# EasyEDA Pro project Universal Receiver.epro

# Schematic Schematic
Board Name: Universal Receiver; Create Date: 2025-03-07; Page Name: Schematic; Project Name: Universal Receiver; Schematic Name: Schematic; Update Date: 2025-03-08; Add into BOM: yes; Company: MUS; Convert to PCB: yes; Date: 2025-03-07; REV: 1.0; Sheet: 1/1
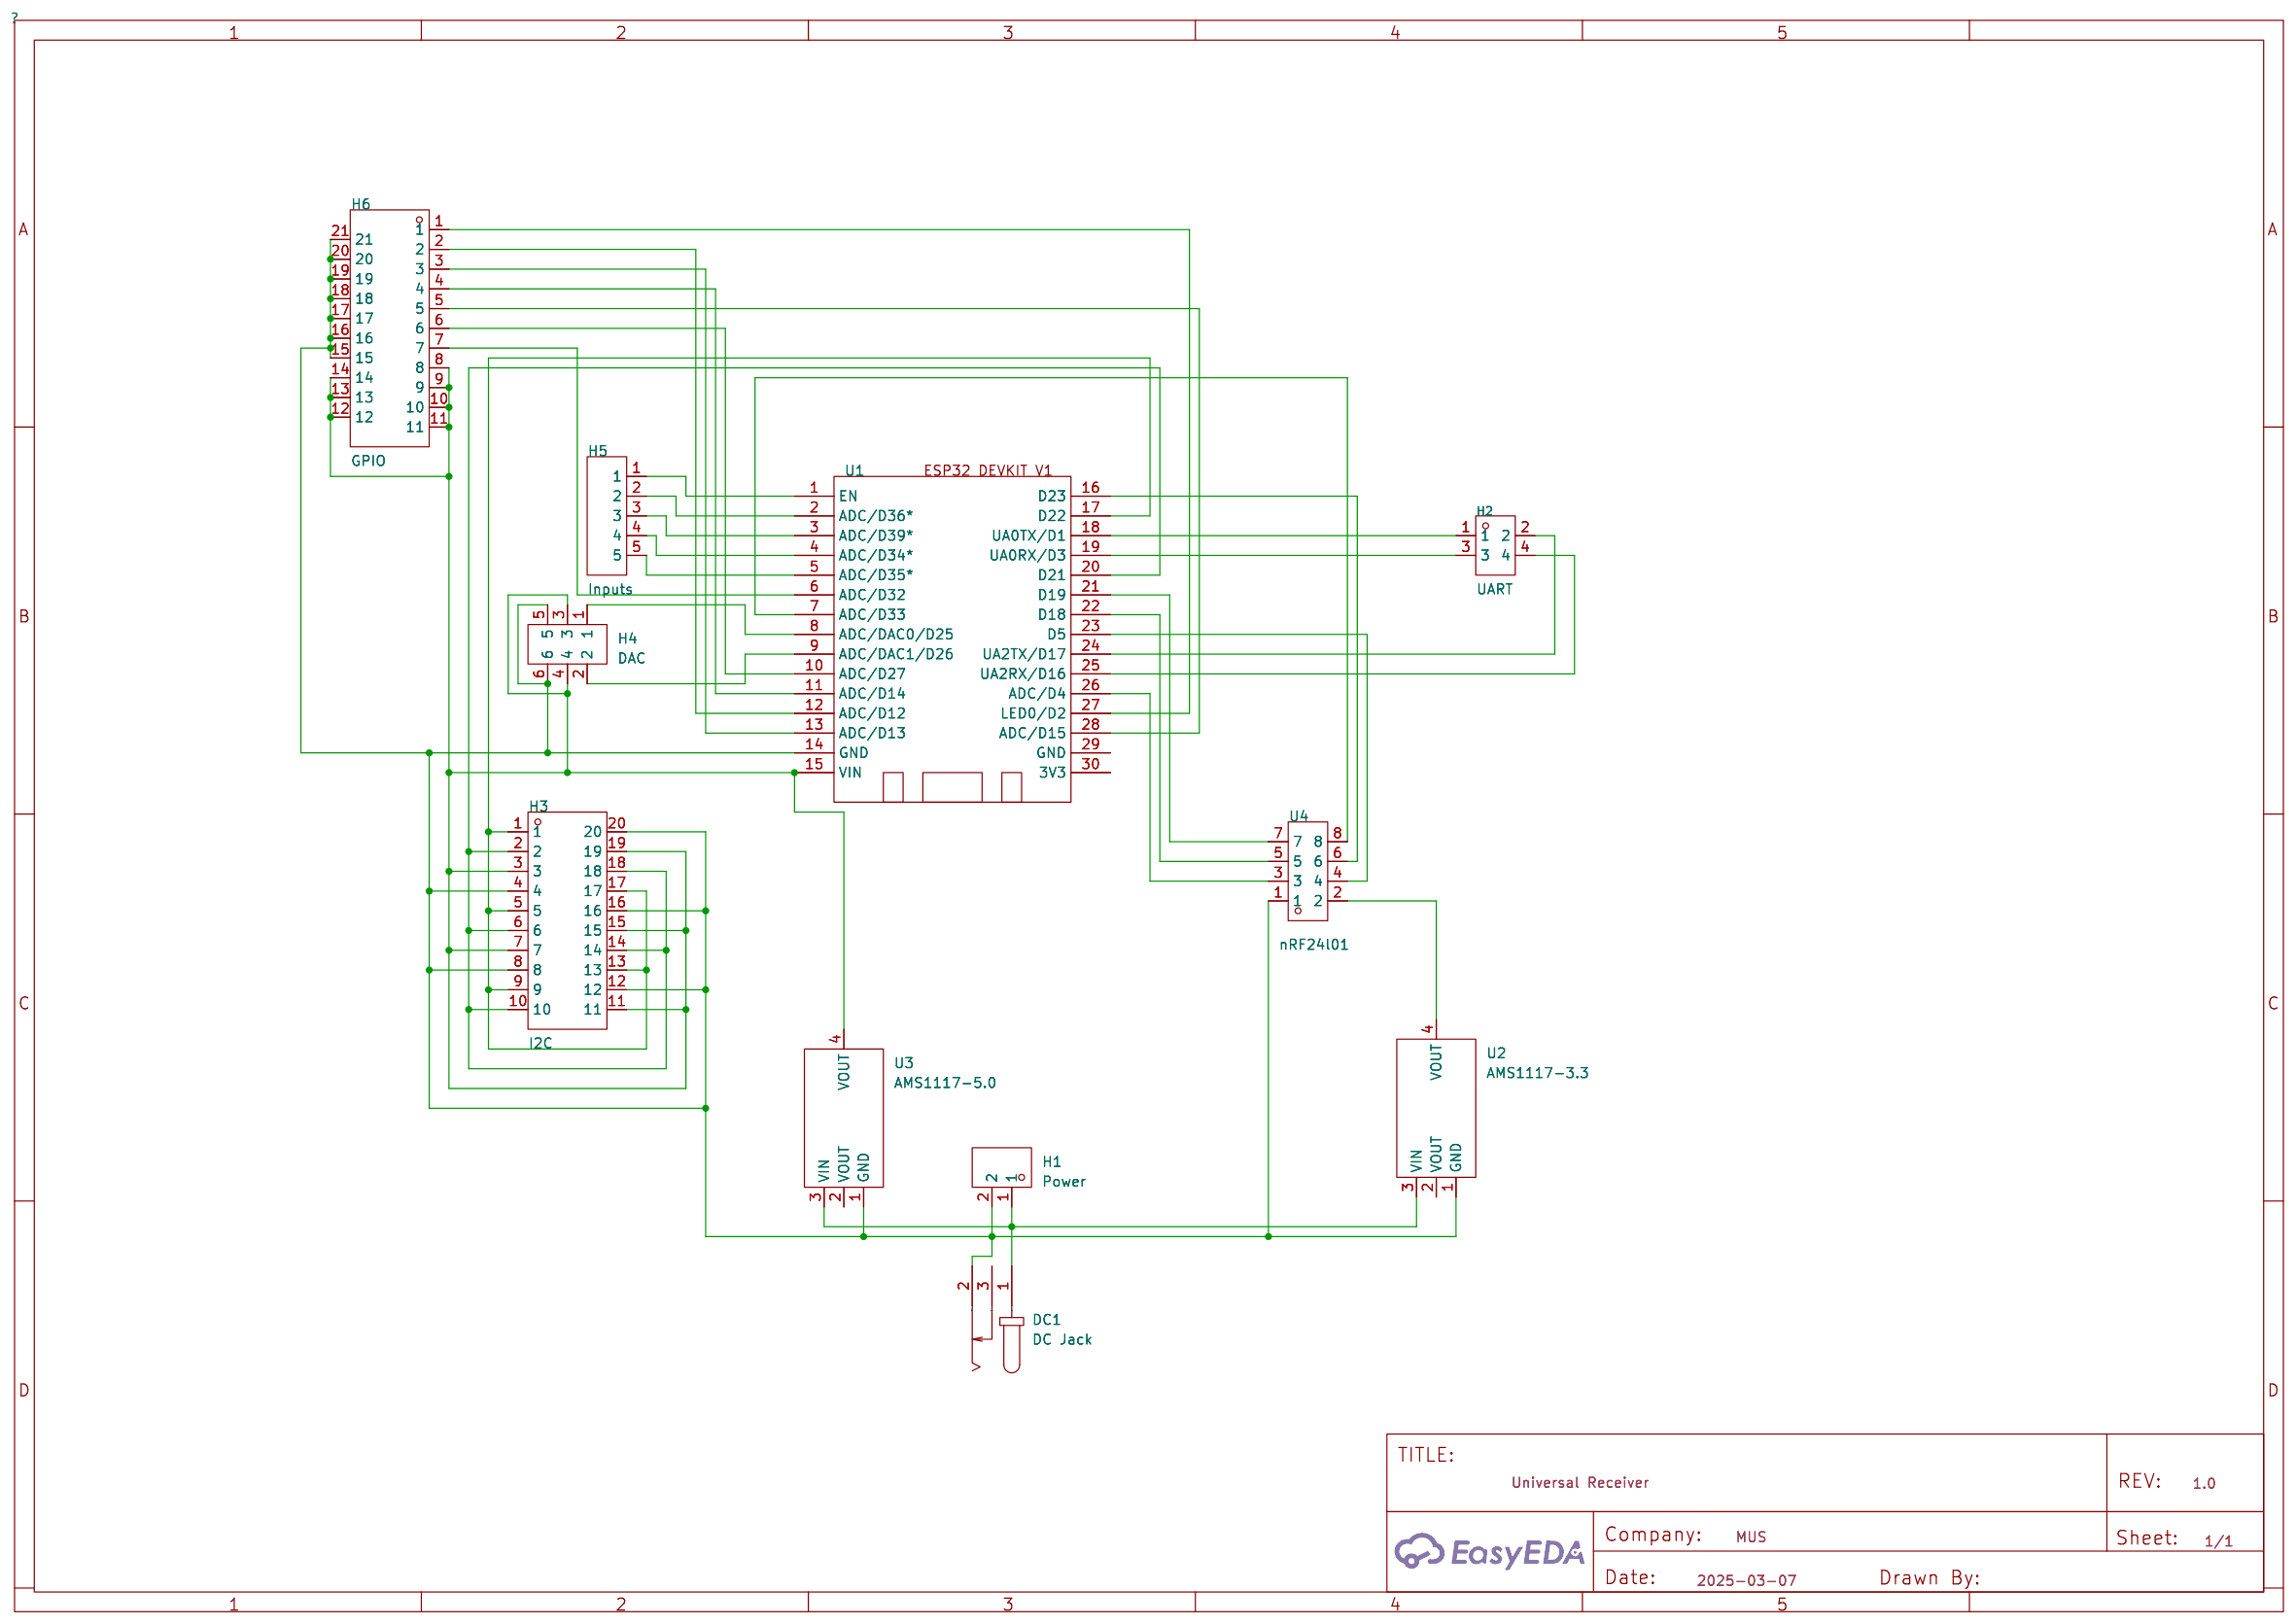
[diagram p0: schematic sheet]

## Parts
DC1  DC Jack  [DC-IN-TH_DC-005-5A-2.0]
H1  Power  [HDR-TH_2P-P2.54-V-M_5]
H2  UART  [HDR-TH_4P-P2.54-V-M-R2-C2-S2.54]
H3  I2C  [HDR-TH_20P-P2.54-V-M-R4-C5-S2.54]
H4  DAC  [HDR-TH_6P-P2.54-V-M-R2-C3-S2.54]
H5  Inputs  [HDR-TH_5P-P2.54-V-M]
H6  GPIO  [CONN-TH_HX-PZ2.54-3X7P-ZZ]
U1  -  [ESP32 Devkit V1]
U2  AMS1117-3.3  [SOT-223-3_L6.5-W3.4-P2.30-LS7.0-BR]
U3  AMS1117-5.0  [SOT-223_L6.5-W3.5-P2.30-LS7.0-BR]
U4  nRF24l01  [HDR-TH_8P-P2.54-V-F-R2-C4-S2.54]

## Library data of the parts
DC1 = DC-005-5A-2.0: Connector Type:DC Power Receptacle Mounting Style:Bend insert Inside Contact Diameter:2mm Outside Contact Diameter:6.2mm Current Rating (Max):5A Voltage Rating (Max):24V Operating Temperature Range:-20℃~+70℃ Operating Temperature Range:-20℃~+70℃; LCSC Part Name: DC电源插座 内径:2mm 外径:6.2mm; Supplier Part: C381116; Manufacturer: XKB Connection(中国星坤); Supplier Footprint: 插件; JLCPCB Part Class: Extended Part; Datasheet: https://atta.szlcsc.com/upload/public/pdf/source/20211015/707A35F7AB6E89C57AAB641950105BB7.pdf; Supplier: LCSC; Connector Type: DC Power Receptacle; Mounting Style: Bend insert; Inside Contact Diameter: 2mm; Outside Contact Diameter: 6.2mm; Current Rating (Max): 5A; Voltage Rating (Max): 24V; Operating Temperature Range: -20℃~+70℃
H1 = PZ254-1-02-Z-C: Pin Structure:1x2P Pitch:2.54mm Row Spacing:- Circluar Pins/Square Pins:Circular Pins Mounting Type:Straight Number of Rows:Plugin Number of Pins:2P Current Rating (Max):3A Length of Mating Pin:4.13mm Insulation Height:3mm Length of End Connection Pin:3mm; LCSC Part Name: 1x2P 间距:2.54mm 圆针 直插; Supplier Part: C5156429; Manufacturer: HCTL(华灿天禄); Supplier Footprint: 插件,P=2.54mm; JLCPCB Part Class: Extended Part; Datasheet: https://atta.szlcsc.com/upload/public/pdf/source/20230609/791AB95BE9F63E00E86E05F9E750B3EF.pdf; Supplier: LCSC; Pin Structure: 1x2P; Pitch: 2.54mm; Circluar Pins/Square Pins: Circular Pins; Mounting Type: Straight; Number of Rows: Plugin; Number of Pins: 2P; Current Rating (Max): 3A; Length of Mating Pin: 4.13mm; Insulation Height: 3mm; Length of End Connection Pin: 3mm; Contact Plating: Gold; Operating Temperature Range: -40℃~+105℃; Soldering Temperature(Max): 260℃@10S; Color: Black
H2 = PZ254-2-02-Z-2.5-G1: Pin Structure:2x2P Pitch:2.54mm Row Spacing:2.54mm Circluar Pins/Square Pins:Square Pins Mounting Type:Straight Number of Rows:双排 Number of Pins:4P Current Rating (Max):3A Length of Mating Pin:6mm Insulation Height:2.5mm Length of End Connection Pin:3mm C; LCSC Part Name: 2x2P 间距:2.54mm 方针 直插; Supplier Part: C18197997; Manufacturer: HCTL(华灿天禄); Supplier Footprint: 插件,P=2.54mm; JLCPCB Part Class: Extended Part; Datasheet: https://atta.szlcsc.com/upload/public/pdf/source/20230921/D8C53D635FAFF8233B09D1367D616037.pdf; Supplier: LCSC; Pin Structure: 2x2P; Pitch: 2.54mm; Row Spacing: 2.54mm; Circluar Pins/Square Pins: Square Pins; Mounting Type: Straight; Number of Rows: 双排; Number of Pins: 4P; Current Rating (Max): 3A; Length of Mating Pin: 6mm; Insulation Height: 2.5mm; Length of End Connection Pin: 3mm; Operating Temperature Range: -40℃~+105℃; Soldering Temperature(Max): 260℃@10S; Color: Black
H3 = HX PZ2.54-4x5P ZZ: Pin Structure:4x5P Pitch:2.54mm Row Spacing:2.54mm Circluar Pins/Square Pins:Policy Mounting Type:Direct Insert Number of Rows:Four rows Number of Pins:20P Current Rating (Max):3A Voltage Rating (Max):- Length of Mating Pin:6mm Insulation Height:2.5mm Len; LCSC Part Name: 4x5P 间距:2.54mm 方针 直插; Supplier Part: C32713299; Manufacturer: hanxia(韩下); Supplier Footprint: 插件,P=2.54mm; JLCPCB Part Class: Extended Part; Datasheet: https://atta.szlcsc.com/upload/public/pdf/source/20240723/6A176166D1A76A78CC2FA8FC287512BB.pdf; Supplier: LCSC; Pin Structure: 4x5P; Pitch: 2.54mm; Row Spacing: 2.54mm; Circluar Pins/Square Pins: Policy; Mounting Type: Direct Insert; Number of Rows: Four rows; Number of Pins: 20P; Current Rating (Max): 3A; Length of Mating Pin: 6mm; Insulation Height: 2.5mm; Length of End Connection Pin: 3mm; Contact Material: Brass; Contact Plating: Gold; Operating Temperature Range: -40℃~+105℃; Color: Black
H4 = DS1021-2x3SF11-B: Pin Structure:2x3P Pitch:2.54mm Mounting Type:Straight Number of Rows:Double Row Number of Pins:6P; LCSC Part Name: 2x3P 间距:2.54mm 直插; Supplier Part: C7430399; Manufacturer: CONNFLY; Supplier Footprint: 插件,P=2.54mm; JLCPCB Part Class: Extended Part; Datasheet: https://atta.szlcsc.com/upload/public/pdf/source/20241114/CDE0584BC14A5BF7A4A12431B1315AA3.pdf; Supplier: LCSC; Pin Structure: 2x3P; Pitch: 2.54mm; Mounting Type: Straight; Number of Rows: Double Row; Number of Pins: 6P
H5 = PZ254V-11-05P: Pin Structure:1x5P Pitch:2.54mm Row Spacing:- Circluar Pins/Square Pins:Policy Mounting Type:Straight Number of Rows:Single Row Number of Pins:5P Current Rating:- Voltage Rating (Max):- Length of Mating Pin:6mm Insulation Height:2.5mm Length of End Connec; LCSC Part Name: 1x5P 间距:2.54mm 方针 直插; Supplier Part: C492404; Manufacturer: XFCN(兴飞); Supplier Footprint: 插件,P=2.54mm; JLCPCB Part Class: Extended Part; Datasheet: https://atta.szlcsc.com/upload/public/pdf/source/20200309/C492404_E51533260F8710EFF5D4617281164C1D.pdf; Supplier: LCSC; Pin Structure: 1x5P; Pitch: 2.54mm; Circluar Pins/Square Pins: Policy; Mounting Type: Straight; Number of Rows: Single Row; Number of Pins: 5P; Length of Mating Pin: 6mm; Insulation Height: 2.5mm; Length of End Connection Pin: 3mm; Contact Material: Brass; Operating Temperature: -40℃~+105℃; Color: Black
H6 = HX PZ2.54-3x7P ZZ: Pin Structure:3x7P Pitch:2.54mm Row Spacing:2.54mm Circluar Pins/Square Pins:Policy Mounting Type:Straight Number of Rows:Triple row Number of Pins:21P Current Rating:3A Voltage Rating (Max):- Length of Mating Pin:6mm Insulation Height:2.5mm Length of End; LCSC Part Name: 3x7P 间距:2.54mm 方针 直插; Supplier Part: C32713294; Manufacturer: hanxia(韩下); Supplier Footprint: 插件,P=2.54mm; JLCPCB Part Class: Extended Part; Datasheet: https://atta.szlcsc.com/upload/public/pdf/source/20240723/0865035114635720ADAE8B7B33218890.pdf; Supplier: LCSC; Pin Structure: 3x7P; Pitch: 2.54mm; Row Spacing: 2.54mm; Circluar Pins/Square Pins: Policy; Mounting Type: Straight; Number of Rows: Triple row; Number of Pins: 21P; Current Rating: 3A; Length of Mating Pin: 6mm; Insulation Height: 2.5mm; Length of End Connection Pin: 3mm; Contact Material: Brass; Contact Plating: Gold; Operating Temperature: -40℃~+105℃; Color: Black
U1 = ESP32 Devkit V1
U2 = AMS1117-3.3_C6186: Output Type:Fixed Voltage - Supply:- Output Voltage:3.3V Output Voltage:3.3V Output Current:1A Power Supply Rejection Ratio (PSRR):72dB@(120Hz) Voltage Dropout:1.3V@(800mA) standby current:- Noise:- Features:Overcurrent Protection(OCP)；Thermal Protection(; LCSC Part Name: 输出3.3V 1A; Supplier Part: C6186; Manufacturer: AMS; Supplier Footprint: SOT-223; JLCPCB Part Class: Basic Part; Datasheet: https://atta.szlcsc.com/upload/public/pdf/source/20180727/C6186_7A095716F0823C02F1997A905E26C086.pdf; Supplier: LCSC; Output Type: Fixed; Output Voltage: 3.3V; Output Current: 1A; Power Supply Rejection Ratio (PSRR): 72dB@(120Hz); Voltage Dropout: 1.3V@(800mA); Features: Overcurrent Protection(OCP)；Thermal Protection(TSD); Output Configuration: Positive electrode; Number of Outputs: 1
U3 = AMS1117-5.0_C6187: Output Type:Fixed Voltage - Supply:12V Output Voltage:5V Output Voltage:5V Output Current:1A Power Supply Rejection Ratio (PSRR):- Voltage Dropout:1.3V@(1A) standby current:- Noise:- Features:Overcurrent Protection(OCP) Operating Temperature:- Operating T; LCSC Part Name: 输入12V 输出5V 1A; Supplier Part: C6187; Manufacturer: AMS; Supplier Footprint: SOT-223; JLCPCB Part Class: Basic Part; Datasheet: https://atta.szlcsc.com/upload/public/pdf/source/20230918/E4B716057EE82179D88E8A0894830D59.pdf; Supplier: LCSC; Output Type: Fixed; Voltage - Supply: 12V; Output Voltage: 5V; Output Current: 1A; Voltage Dropout: 1.3V@(1A); Features: Overcurrent Protection(OCP); Output Configuration: Positive electrode; Number of Outputs: 1
U4 = 2.54-2*4: Holes Structure:2x4P Pitch:2.54mm Row Spacing:2.54mm Circular Hole / Square Hole:Square Holes Mounting Type:Straight Number of Rows:双排 Number of Holes:8P Current Rating (Max):2.5A Voltage Rating (Max):- Holes Direction:Top Insulation Height:8.5mm Operatin; LCSC Part Name: 间距:2.54mm 2x4P 直插; Supplier Part: C2977588; Manufacturer: ZHOURI(洲日); Supplier Footprint: 插件,P=2.54mm; JLCPCB Part Class: Extended Part; Datasheet: https://atta.szlcsc.com/upload/public/pdf/source/20220328/363EB391BC0EB759CF231FC910753CBE.pdf; Supplier: LCSC; Holes Structure: 2x4P; Pitch: 2.54mm; Row Spacing: 2.54mm; Circular Hole / Square Hole: Square Holes; Mounting Type: Straight; Number of Rows: 双排; Number of Holes: 8P; Current Rating (Max): 2.5A; Holes Direction: Top; Insulation Height: 8.5mm; Operating Temperature Range: -40℃~+105℃

## Nets
$1N346: DC1.1 H1.1 U2.3(VIN) U3.3(VIN)
$1N376: H3.1 H3.5 H3.9 H3.13 H3.17 U1.17(D22)
$1N382: H3.2 H3.6 H3.10 H3.14 H3.18 U1.20(D21)
$1N389: H3.3 H3.7 H3.11 H3.15 H3.19 H4.3 H4.4 H6.8 H6.9 H6.10 H6.11 H6.12 H6.13 H6.14 U1.15(VIN) U3.4(VOUT)
$1N396: DC1.2 H1.2 H3.4 H3.8 H3.12 H3.16 H3.20 H4.5 H4.6 H6.15 H6.16 H6.17 H6.18 H6.19 H6.20 H6.21 U1.14(GND) U2.1(GND) U3.1(GND) U4.1
$1N934: U2.4(VOUT) U4.2
$1N970: U1.26(ADC/D4) U4.3
$1N976: U1.22(D18) U4.5
$1N983: U1.21(D19) U4.7
$1N990: U1.7(ADC/D33) U4.8
$1N998: U1.16(D23) U4.6
$1N1005: U1.23(D5) U4.4
$1N1349: H2.3 U1.19(UA0RX/D3)
$1N1355: H2.1 U1.18(UA0TX/D1)
$1N1359: H2.2 U1.24(UA2TX/D17)
$1N1366: H2.4 U1.25(UA2RX/D16)
$1N1470: H4.1 U1.8(ADC/DAC0/D25)
$1N1476: H4.2 U1.9(ADC/DAC1/D26)
$1N1730: H5.5 U1.5(ADC/D35*)
$1N1735: H5.4 U1.4(ADC/D34*)
$1N1742: H5.3 U1.3(ADC/D39*)
$1N1749: H5.2 U1.2(ADC/D36*)
$1N1759: H5.1 U1.1(EN)
$1N2197: H6.1 U1.27(LED0/D2)
$1N2203: H6.2 U1.12(ADC/D12)
$1N2209: H6.3 U1.13(ADC/D13)
$1N2216: H6.4 U1.11(ADC/D14)
$1N2223: H6.5 U1.28(ADC/D15)
$1N2230: H6.6 U1.10(ADC/D27)
$1N2243: H6.7 U1.6(ADC/D32)

Not connected (* = marked no-connect by the designer): DC1 3; U1 29(GND) 30(3V3); U2 2(VOUT); U3 2(VOUT)

# Board PCB
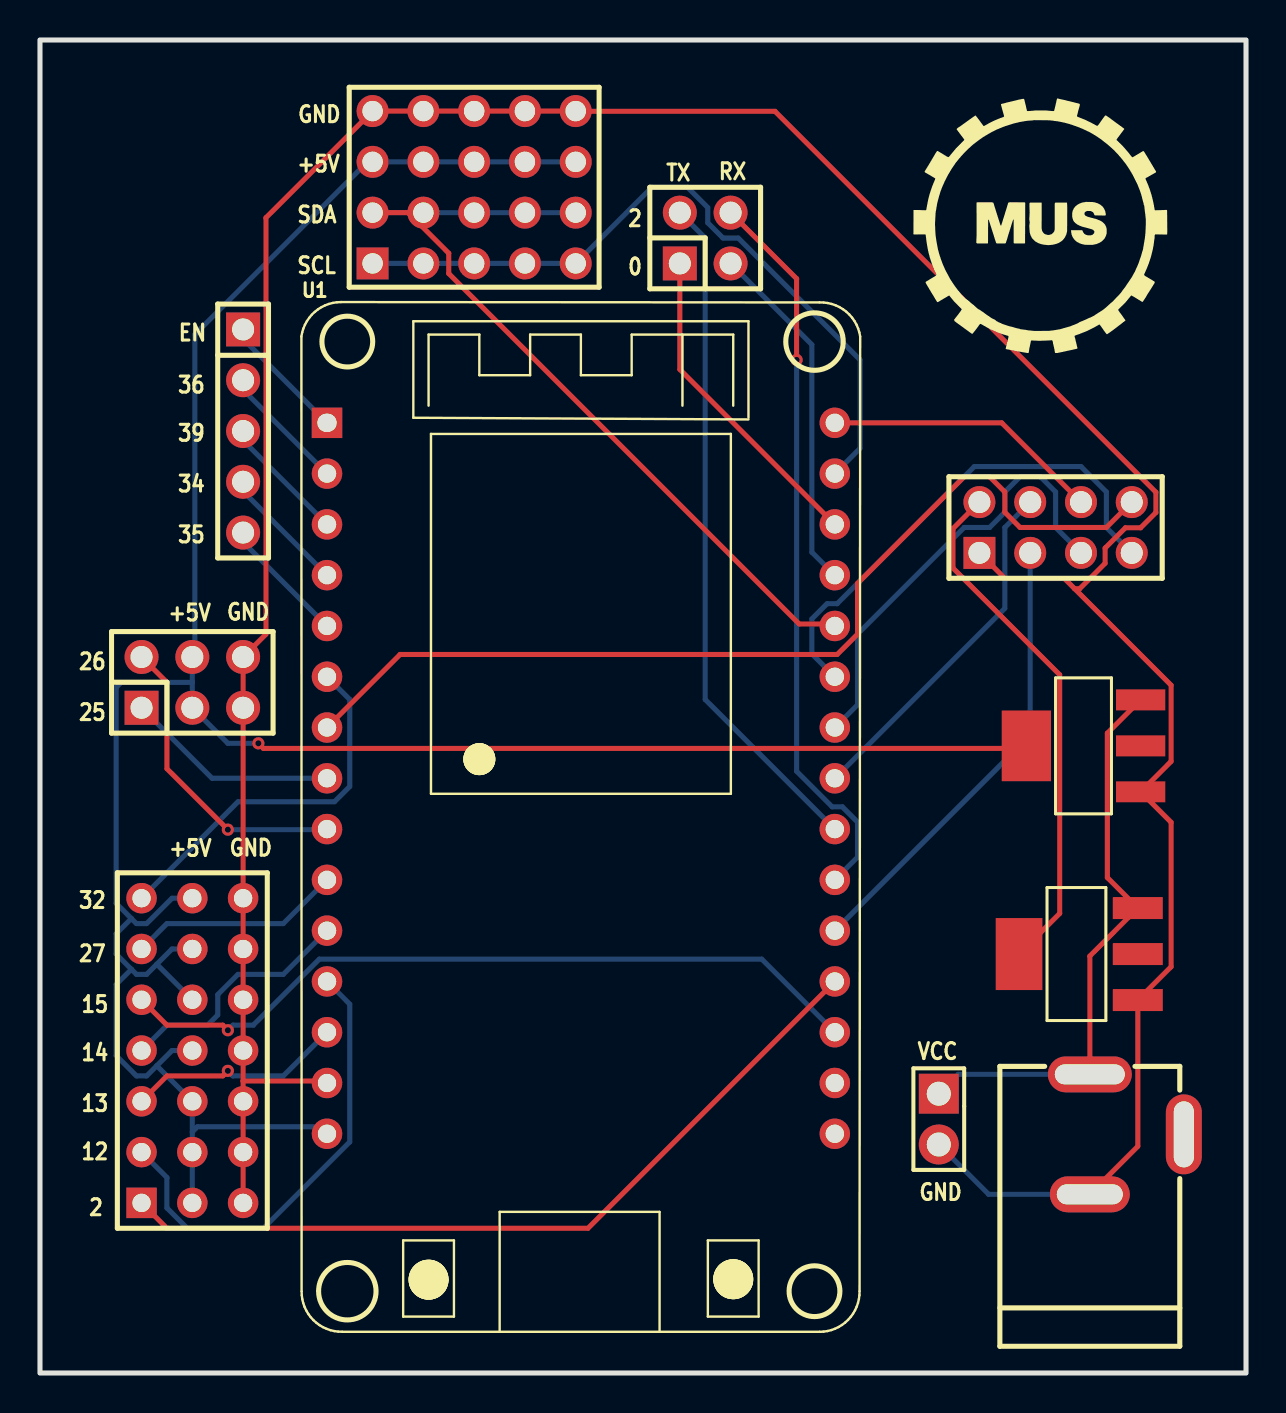
[diagram p1: board, top side]
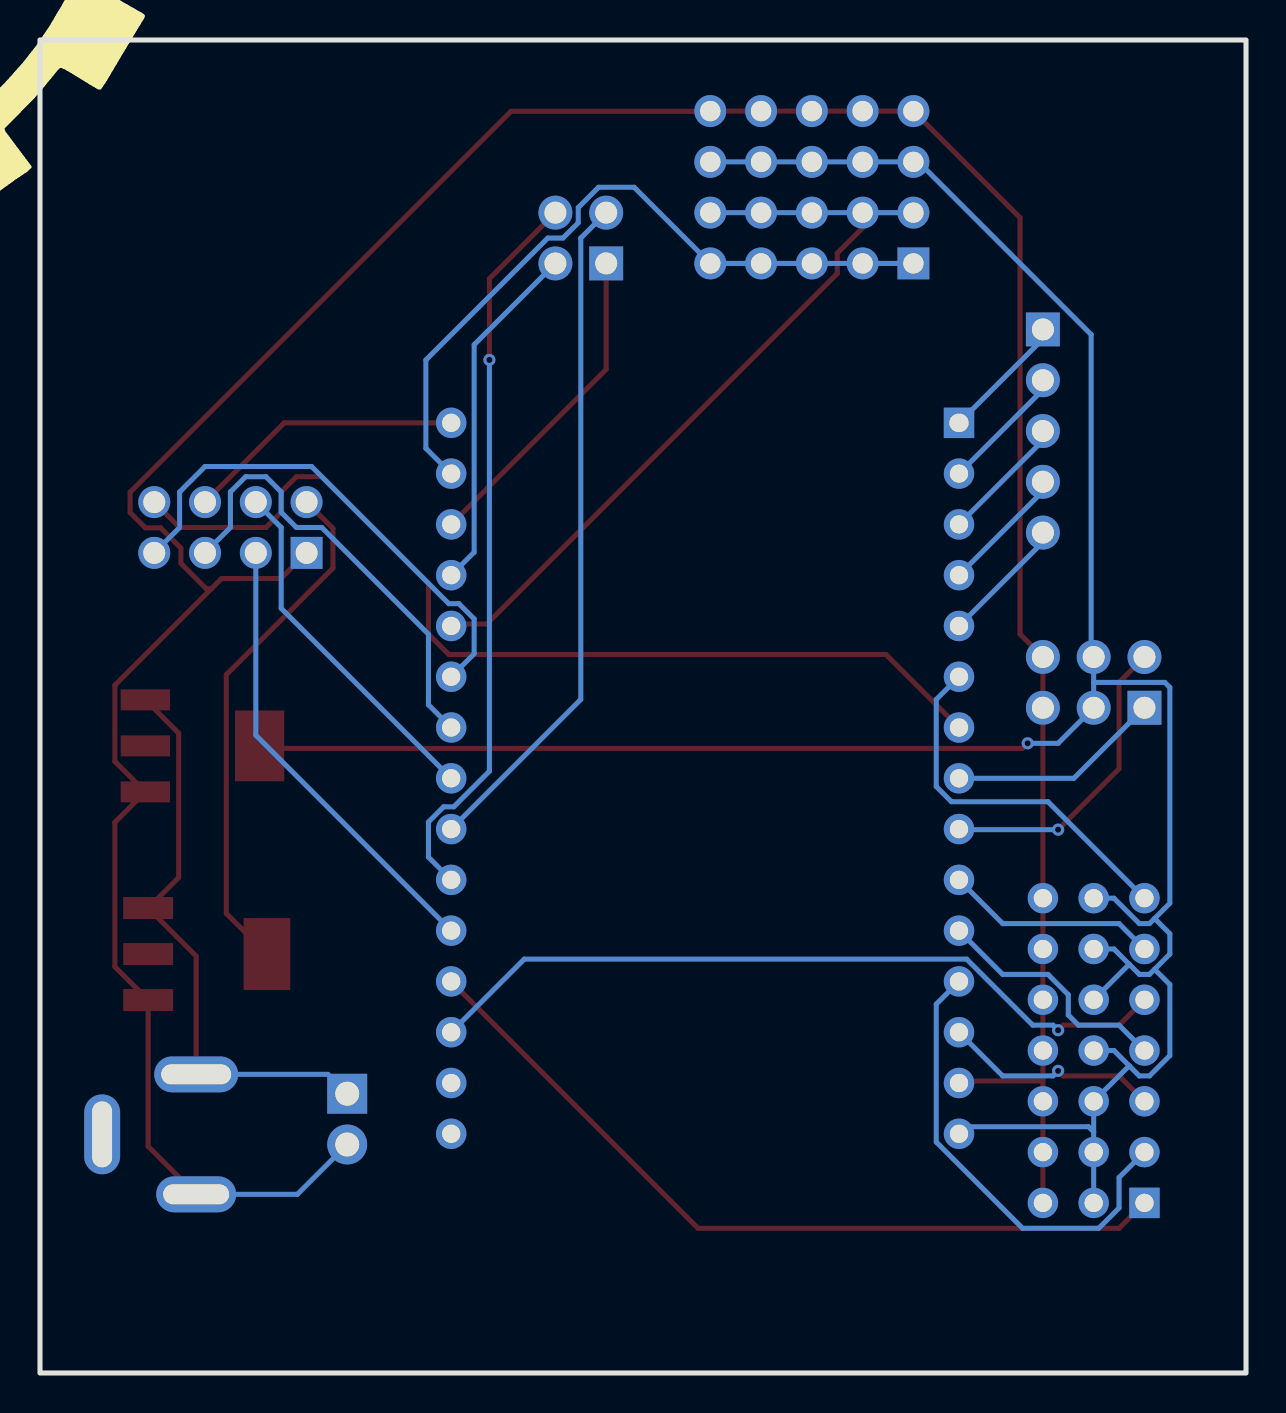
[diagram p2: board, bottom side, seen from below]

Outline 60.32 x 66.67 mm; copper layers: Top Layer, Bottom Layer. Coordinates in mm from the lower left corner of the outline.
Outline path: rectangle 0,66.67 60.32,0
Stack: Top Layer 0.035mm / Dielectric1 1.51mm FR4 er 4.5 / Bottom Layer 0.035mm

## Design rules (mm)
template: JLCPCB Capability(Two Layers Board)
spacing copperThickness1oz (default): track to track 0.102, other pairs 0.152 to 0.3
spacing copperThickness2oz: track to track 0.203, other pairs 0.152 to 0.3
track width copperThickness1oz (default): min 0.127, default 0.254, max 2.54
track width copperThickness2oz: min 0.203, default 0.254, max 2.54
differential pair differentialPair (default): width min 0.127, default 0.254, max 2.54; gap min 0.152, default 0.152
via viaSize (default): diameter min 0.5, default 0.61, max 10; hole min 0.3, default 0.305, max 6.3

## Placement (name value [footprint] x y rotation side)
DC1  DC Jack  [DC-IN-TH_DC-005-5A-2.0]  54.86 11.94 90 top
H1  Power  [HDR-TH_2P-P2.54-V-M_5]  44.96 12.7 270 top
H2  UART  [HDR-TH_4P-P2.54-V-M-R2-C2-S2.54]  33.27 56.77 0 top
H3  I2C  [HDR-TH_20P-P2.54-V-M-R4-C5-S2.54]  21.72 59.31 0 top
H4  DAC  [HDR-TH_6P-P2.54-V-M-R2-C3-S2.54]  7.62 34.54 0 top
H5  Inputs  [HDR-TH_5P-P2.54-V-M]  10.16 47.12 270 top
H6  GPIO  [CONN-TH_HX-PZ2.54-3X7P-ZZ]  7.62 16.13 90 top
U1  -  [ESP32 Devkit V1]  27.05 27.81 0 top
U2  AMS1117-3.3  [SOT-223-3_L6.5-W3.4-P2.30-LS7.0-BR]  51.94 20.95 0 top
U3  AMS1117-5.0  [SOT-223_L6.5-W3.5-P2.30-LS7.0-BR]  52.2 31.37 0 top
U4  nRF24l01  [HDR-TH_8P-P2.54-V-F-R2-C4-S2.54]  50.8 42.29 0 top

## Footprints (pads in the part's own frame, mm; a bottom-side part is the same pattern mirrored in y, then rotated)
CONN-TH_HX-PZ2.54-3X7P-ZZ
  rect 1.524x1.524 hole 0.914: 1(-7.62,2.54)
  round 1.524 hole 0.914: 2(-5.08,2.54) 3(-2.54,2.54) 4(0,2.54) 5(2.54,2.54) 6(5.08,2.54) 7(7.62,2.54) 8(-7.62,0) 9(-5.08,0) 10(-2.54,0) 11(0,0) 12(2.54,0) 13(5.08,0) 14(7.62,0) 15(-7.62,-2.54) 16(-5.08,-2.54) 17(-2.54,-2.54) 18(0,-2.54) 19(2.54,-2.54) 20(5.08,-2.54) 21(7.62,-2.54)
DC-IN-TH_DC-005-5A-2.0
  oval 1.8x4.2 hole 1x3.5: 1(3,2.352)
  oval 1.8x4 hole 1x3.3: 2(-3,2.352)
  oval 4x1.8 hole 3.3x1: 3(-0.001,-2.352)
ESP32 Devkit V1
  rect 1.524x1.524 hole 0.96x0.914: 1(-12.694,19.713)
  round 1.524 hole 0.914: 2(-12.694,17.173) 3(-12.694,14.633) 4(-12.694,12.093) 5(-12.694,9.553) 6(-12.694,7.013) 7(-12.694,4.473) 8(-12.694,1.933) 9(-12.694,-0.607) 10(-12.694,-3.147) 11(-12.694,-5.687) 12(-12.694,-8.227) 13(-12.694,-10.767) 14(-12.694,-13.307) 15(-12.694,-15.847) 16(12.706,19.713) 17(12.706,17.173) 18(12.706,14.633) 19(12.706,12.093) 20(12.706,9.553) 21(12.706,7.013) 22(12.706,4.473) 23(12.706,1.933) 24(12.706,-0.607) 25(12.706,-3.147) 26(12.706,-5.687) 27(12.706,-8.227) 28(12.706,-10.767) 29(12.706,-13.307) 30(12.706,-15.847)
HDR-TH_2P-P2.54-V-M_5
  rect 2x2 hole 1.2: 1(-1.27,0)
  round 2 hole 1.2: 2(1.27,0)
HDR-TH_4P-P2.54-V-M-R2-C2-S2.54
  rect 1.7x1.7 hole 1.1: 1(-1.27,-1.27)
  round 1.7 hole 1.1: 2(-1.27,1.27) 3(1.27,-1.27) 4(1.27,1.27)
HDR-TH_5P-P2.54-V-M
  rect 1.7x1.7 hole 1.1: 1(-5.08,0)
  round 1.7 hole 1.1: 2(-2.54,0) 3(0,0) 4(2.54,0) 5(5.08,0)
HDR-TH_6P-P2.54-V-M-R2-C3-S2.54
  rect 1.7x1.7 hole 1.1: 1(-2.54,-1.27)
  round 1.7 hole 1.1: 2(-2.54,1.27) 3(0,-1.27) 4(0,1.27) 5(2.54,-1.27) 6(2.54,1.27)
HDR-TH_8P-P2.54-V-F-R2-C4-S2.54
  rect 1.6x1.6 hole 1.1: 1(-3.81,-1.27)
  round 1.6 hole 1.1: 2(-3.81,1.27) 3(-1.27,-1.27) 4(-1.27,1.27) 5(1.27,-1.27) 6(1.27,1.27) 7(3.81,-1.27) 8(3.81,1.27)
HDR-TH_20P-P2.54-V-M-R4-C5-S2.54
  rect 1.6x1.6 hole 1.02: 1(-5.08,-3.81)
  round 1.6 hole 1.02: 2(-5.08,-1.27) 3(-5.08,1.27) 4(-5.08,3.81) 5(-2.54,-3.81) 6(-2.54,-1.27) 7(-2.54,1.27) 8(-2.54,3.81) 9(0,-3.81) 10(0,-1.27) 11(0,1.27) 12(0,3.81) 13(2.54,-3.81) 14(2.54,-1.27) 15(2.54,1.27) 16(2.54,3.81) 17(5.08,-3.81) 18(5.08,-1.27) 19(5.08,1.27) 20(5.08,3.81)
SOT-223-3_L6.5-W3.4-P2.30-LS7.0-BR
  rect 2.5x1.1 smd: 1(2.97,-2.3) 2(2.97,0) 3(2.97,2.3)
  rect 2.34x3.6 smd: 4(-2.97,0)
SOT-223_L6.5-W3.5-P2.30-LS7.0-BR
  rect 2.465x1.05 smd: 1(2.857,-2.3) 2(2.857,0) 3(2.857,2.3)
  rect 2.465x3.54 smd: 4(-2.857,0)

## Nets
As in the schematic.

Pads without a net: DC1 3; U1 29 30; U2 2; U3 2

## Via types
v1: diameter 0.61, hole 0.305, Top Layer to Bottom Layer, 5 vias

## Routing (per net, layer and track width the routed paths; a pad name or vN(x,y) marks a point on that pad's centre or on a via; arc(x,y) is an arc through that point)
$1N346: length 29
  Top Layer w0.254: DC1.1 52.51,20.85 U2.3 53.39,24.78 53.39,32 U3.3
  Bottom Layer w0.254: H1.1 45.93,14.94 DC1.1
$1N376: length 36.2
  Bottom Layer w0.254: H3.1 H3.9 H3.13 26.8,55.5 30.61,59.31 32.38,59.31 33.4,58.29 33.4,57.53 34.16,56.77 34.93,56.77 41.02,50.67 41.02,46.25 U1.17
$1N382: length 42.4
  Top Layer w0.254: U1.20 39.66,37.47 37.97,37.47 20.45,54.99 20.45,56.01 18.41,58.04 H3.2
  Bottom Layer w0.254: H3.2 H3.10 H3.14 26.8,58.04
$1N389: length 136.8
  Top Layer w0.254: U3.4 49.21,31.24 11.18,31.24 v1(10.92,31.5)
  Bottom Layer w0.254: 5.84,15.37 6.6,16.13 H6.11 ; 5.84,15.37 5.33,14.86 4.83,14.86 3.81,15.88 3.81,19.43 4.57,20.19 ; 5.84,15.37 H6.10 7.62,12.06 ; 7.62,34.54 H4.3 9.4,31.5 v1(10.92,31.5) ; 7.62,34.54 H4.4 7.75,35.94 7.75,51.94 16.38,60.58 H3.3 H3.11 H3.15 26.8,60.58 ; 7.62,34.54 4.06,34.54 3.81,34.29 3.81,23.5 4.57,22.73 ; 4.57,22.73 3.81,21.97 3.81,20.95 4.57,20.19 ; 4.57,22.73 4.83,22.48 5.33,22.48 6.6,23.75 7.62,23.75 ; 4.57,20.19 4.83,19.94 5.33,19.94 5.84,20.45 ; U1.15 14,12.32 7.87,12.32 7.62,12.06 ; 7.62,12.06 H6.9 H6.8 ; H6.13 6.6,21.21 5.84,20.45 ; 5.84,20.45 7.62,18.67
$1N396: length 165
  Top Layer w0.254: U1.14 14.26,14.61 10.16,14.61 ; 10.16,14.61 H6.17 H6.16 H6.15 ; 10.16,14.61 H6.18 H6.20 H4.5 H4.6 11.3,36.96 11.3,57.78 H3.4 H3.12 H3.16 26.8,63.12 26.81,63.11 36.77,63.11 55.82,44.06 55.82,43.04 55.05,42.28 54.29,42.28 53.28,41.26 53.28,40.5 52.01,39.23 51.75,39.23 ; 51.75,39.23 51.24,39.74 48.27,39.74 U4.1 ; 51.75,39.23 56.58,34.4 56.58,30.59 U3.1 56.58,27.55 56.58,20.32 U2.1 54.91,11.34 DC1.2
  Bottom Layer w0.254: H1.2 47.45,8.94 DC1.2
$1N934: length 26.2
  Top Layer w0.254: U2.4 51,22.99 51,34.92 45.67,40.26 45.67,42.24 U4.2
$1N970: length 22.9
  Bottom Layer w0.254: U1.26 49.53,31.9 U4.3
$1N976: length 22.8
  Bottom Layer w0.254: U4.5 50.8,42.29 50.8,44.07 50.04,44.83 49.02,44.83 48.26,44.07 48.26,43.05 47.5,42.29 46.23,42.29 40.89,36.96 40.89,33.42 U1.22
$1N983: length 25.4
  Bottom Layer w0.254: U1.21 38.61,35.97 38.61,37.72 39.37,38.48 39.88,38.48 46.74,45.34 52.07,45.34 53.34,44.07 53.34,42.29 U4.7
$1N990: length 49.1
  Top Layer w0.254: U1.7 18.01,35.94 39.88,35.94 40.89,36.96 40.89,39.5 46.23,44.83 47.5,44.83 48.26,44.07 48.26,43.05 49.02,42.29 53.34,42.29 U4.8
$1N998: length 14
  Top Layer w0.254: U4.6 48.1,47.53 U1.16
$1N1005: length 17.9
  Bottom Layer w0.254: U4.4 48.26,42.29 48.26,38.25 U1.23
$1N1349: length 17.8
  Bottom Layer w0.254: H2.3 38.61,51.44 38.61,41.05 U1.19
$1N1355: length 16.3
  Top Layer w0.254: H2.1 32,50.2 U1.18
$1N1359: length 34
  Bottom Layer w0.254: H2.2 33.27,56.77 33.27,33.69 U1.24
$1N1366: length 36.8
  Top Layer w0.254: v1(37.85,50.67) 37.85,54.74 H2.4
  Bottom Layer w0.254: U1.25 40.89,25.8 40.89,27.56 40.13,28.32 39.62,28.32 37.85,30.1 v1(37.85,50.67)
$1N1470: length 10.7
  Bottom Layer w0.254: H4.1 8.61,29.75 U1.8
$1N1476: length 15.4
  Top Layer w0.254: H4.2 6.35,34.54 6.35,30.23 v1(9.4,27.18)
  Bottom Layer w0.254: U1.9 14.33,27.18 v1(9.4,27.18)
$1N1730: length 6.4
  Bottom Layer w0.254: U1.5 10.16,41.56 H5.5
$1N1735: length 6.4
  Bottom Layer w0.254: H5.4 10.16,44.1 U1.4
$1N1742: length 6.4
  Bottom Layer w0.254: H5.3 10.16,46.64 U1.3
$1N1749: length 6.4
  Bottom Layer w0.254: U1.2 10.16,49.18 10.16,49.66
$1N1759: length 6.4
  Bottom Layer w0.254: H5.1 10.16,51.72 U1.1
$1N2197: length 40.3
  Top Layer w0.254: H6.1 6.35,7.24 27.41,7.24 U1.27
$1N2203: length 23.2
  Bottom Layer w0.254: H6.2 6.35,9.78 6.35,8.25 7.37,7.24 11.18,7.24 15.49,11.56 15.49,18.45 U1.12
$1N2209: length 10.9
  Top Layer w0.254: H6.3 6.35,14.86 9.14,14.86 v1(9.4,15.11)
  Bottom Layer w0.254: v1(9.4,15.11) 9.65,14.86 12.17,14.86 U1.13
$1N2216: length 12.4
  Bottom Layer w0.254: H6.4 6.35,17.4 8.38,17.4 8.89,17.91 8.89,18.92 9.91,19.94 12.17,19.94 U1.11
$1N2223: length 38.3
  Top Layer w0.254: v1(9.4,17.14) 9.14,17.4 6.35,17.4 5.08,18.67
  Bottom Layer w0.254: v1(9.4,17.14) 9.65,17.4 10.67,17.4 13.97,20.7 36.1,20.7 U1.28
$1N2230: length 10.7
  Bottom Layer w0.254: H6.6 6.35,22.48 12.17,22.48 U1.10
$1N2243: length 18.7
  Bottom Layer w0.254: U1.6 15.49,33.69 15.49,29.34 14.73,28.58 9.91,28.58 5.08,23.75

## Text on the board
Top Silkscreen Layer: 26 | 25 | 32 | 27 | 15 | 14 | 13 | 12 | 2 | +5V | 36 | 39 | 34 | 35 | GND | SDA | SCL | 0 | TX | RX | VCC | EN
